# Altium schematic sheet DK_STM32L151.SchDoc: lock
size A4; Author: george; Revision: V1.0; SheetNumber: 1
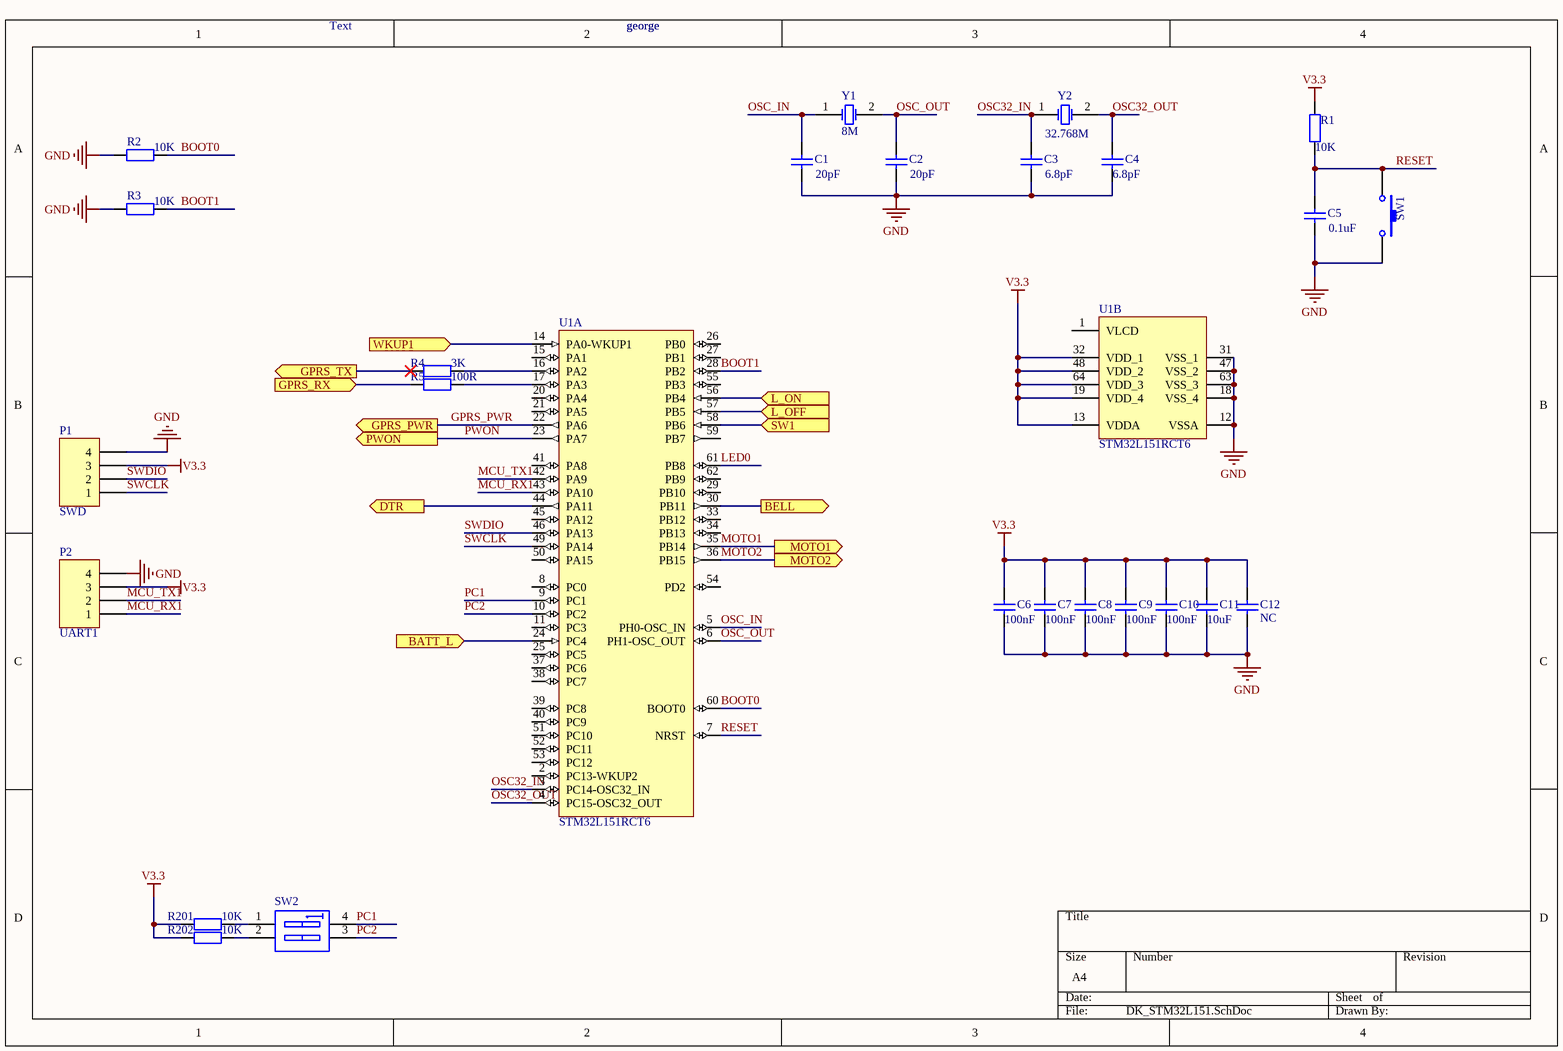
[diagram p0: DK_STM32L151.SchDoc]

## Parts
C1  value 20pF  [0603]  (hidden comment: Cap)
C2  value 20pF  [0603]  (hidden comment: Cap)
C3  value 6.8pF  [0603]  (hidden comment: Cap)
C4  value 6.8pF  [0603]  (hidden comment: Cap)
C5  value 0.1uF  [0603]  (hidden comment: Cap)
C6  value 100nF  [0603]  (hidden comment: Cap)
C7  value 100nF  [0603]  (hidden comment: Cap)
C8  value 100nF  [0603]  (hidden comment: Cap)
C9  value 100nF  [0603]  (hidden comment: Cap)
C10  value 100nF  [1206]  (hidden comment: Cap)
C11  value 10uF  [LC-CASE-A_3216]  (hidden comment: Cap)
C12  NC  [0603]
P1  SWD  [HDR1X4]
P2  UART1  [HDR1X4]
R1  value 10K  [0603]  (hidden comment: Res2)
R2  value 10K  [0603]  (hidden comment: Res2)
R3  value 10K  [0603]  (hidden comment: Res2)
R4  value 3K  [0603]  (hidden comment: Res2)
R5  value 100R  [0603]  (hidden comment: Res2)
R201  value 10K  [0603]  (hidden comment: Res2)
R202  value 10K  [0603]  (hidden comment: Res2)
SW1  SW-PB  [3*6*4.3]  (value not drawn)
SW2  SW DIP-2  [SW-2*4]  (value not drawn)
U1  STM32L151RCT6  [LQFP64]  (parts A,B of 2)
Y1  8M  [SMT-OSC]
Y2  32.768M  [XTAL32.786]

## Ports
BATT_L (in), BELL (out), DTR (out), GPRS_PWR (out), GPRS_RX (in), GPRS_TX (out), L_OFF (in), L_ON (in), MOTO1 (out), MOTO2 (out), PWON (out), SW1 (in), WKUP1 (in)

## Nets
GND: C1.1 C2.1 C3.1 C4.1 C5.2 C6.1 C7.1 C8.1 C9.1 C10.1 C11.1 C12.1 P1.4 P2.4 R2.1 R3.1 SW1.2 U1.12(VSSA) U1.18(VSS_4) U1.31(VSS_1) U1.47(VSS_2) U1.63(VSS_3)
V3.3: C6.2 C7.2 C8.2 C9.2 C10.2 C11.2 C12.2 P1.3 P2.3 R1.1 R201.1 R202.1 U1.13(VDDA) U1.19(VDD_4) U1.32(VDD_1) U1.48(VDD_2) U1.64(VDD_3)
BATT_L: U1.24(PC4) ; port BATT_L
BELL: U1.30(PB11) ; port BELL
BOOT0: R2.2 U1.60(BOOT0)
BOOT1: R3.2 U1.28(PB2)
DTR: U1.44(PA11) ; port DTR
GPRS_PWR: U1.22(PA6) ; port GPRS_PWR
GPRS_RX: R5.1 ; port GPRS_RX
GPRS_TX: R4.1 ; port GPRS_TX
L_OFF: U1.57(PB5) ; port L_OFF
L_ON: U1.56(PB4) ; port L_ON
LED0: U1.61(PB8)
MCU_RX1: P2.1 U1.43(PA10)
MCU_TX1: P2.2 U1.42(PA9)
MOTO1: U1.35(PB14) ; port MOTO1
MOTO2: U1.36(PB15) ; port MOTO2
OSC32_IN: C3.2 U1.3(PC14-OSC32_IN) Y2.1(OSC1)
OSC32_OUT: C4.2 U1.4(PC15-OSC32_OUT) Y2.2(OSC2)
OSC_IN: C1.2 U1.5(PH0-OSC_IN) Y1.1(OSC1)
OSC_OUT: C2.2 U1.6(PH1-OSC_OUT) Y1.2(OSC2)
PC1: SW2.4(B1) U1.9(PC1)
PC2: SW2.3(B2) U1.10(PC2)
PWON: U1.23(PA7) ; port PWON
RESET: C5.1 R1.2 SW1.1 U1.7(NRST)
SW1: U1.58(PB6) ; port SW1
SWCLK: P1.1 U1.49(PA14)
SWDIO: P1.2 U1.46(PA13)
WKUP1: U1.14(PA0-WKUP1) ; port WKUP1
NetR4_2: R4.2 U1.16(PA2)
NetR5_2: R5.2 U1.17(PA3)
NetR201_2: R201.2 SW2.1(A1)
NetR202_2: R202.2 SW2.2(A2)

Not connected (* = marked no-connect by the designer): U1 1(VLCD) 2(PC13-WKUP2) 8(PC0) 11(PC3) 15(PA1) 20(PA4) 21(PA5) 25(PC5) 26(PB0) 27(PB1) 29(PB10) 33(PB12) 34(PB13) 37(PC6) 38(PC7) 39(PC8) 40(PC9) 41(PA8) 45(PA12) 50(PA15) 51(PC10) 52(PC11) 53(PC12) 54(PD2) 55(PB3) 59(PB7) 62(PB9)

## Notes on the sheet
- Text

## Library data of the parts
C1-C11 = Cap: Capacitor; Published: 8-Jun-2000; LatestRevisionDate: 17-Jul-2002; LatestRevisionNote: Re-released for DXP Platform.; PackageReference: RAD-0.3; Publisher: Altium Limited; PackageDescription: Radial Cap, Thru-Hole; 2 Leads; 0.3 in Pin Spacing
C12 = Cap: Capacitor; Value: 10uF; Published: 8-Jun-2000; LatestRevisionDate: 17-Jul-2002; LatestRevisionNote: Re-released for DXP Platform.; PackageReference: RAD-0.3; Publisher: Altium Limited; PackageDescription: Radial Cap, Thru-Hole; 2 Leads; 0.3 in Pin Spacing
P1 P2 = Header 4: Header, 4-Pin; LatestRevisionDate: 17-Jul-2002; LatestRevisionNote: Re-released for DXP Platform.; Publisher: Altium Limited
R1-R5 R201 R202 = Res2: Resistor; Published: 8-Jun-2000; LatestRevisionDate: 17-Jul-2002; LatestRevisionNote: Re-released for DXP Platform.; PackageReference: AXIAL-0.4; Publisher: Altium Limited; PackageDescription: Axial Device, Thru-Hole; 2 Leads; 0.4 in Pin Spacing
SW1 = SW-PB: Switch; Published: 24-Mar-1999; LatestRevisionDate: 17-Jul-2002; LatestRevisionNote: Re-released for DXP Platform.; PackageReference: SPST-2; Publisher: Altium Limited; PackageDescription: Switch; 2 Leads
SW2 = SW DIP-2: DIP Switch, 2 Position, SPST; Published: 24-Mar-1999; LatestRevisionDate: 17-Jul-2002; LatestRevisionNote: Re-released for DXP Platform.; PackageReference: DIP-4; Publisher: Altium Limited
U1 = STM32L151RCT6: ARM Cortex-M3 32-bit MCU, 256 KB Flash, 32 KB Internal RAM, 51 I/Os, 64-pin LQFP, -40 to 85 degC, Tray; Manufacturer: STMicroelectronics; D/A Converter: 2x12-bit (2 Channel); Data E2PROM nom (B): 8192; FLASH Size (Prog) (kB): 256; I/Os (High Current): 51; Internal RAM Size (kB): 32; Supply Voltage(Vcc) min (V): 1.65; DatasheetVersion: Rev. 3; PackageVersion: Rev. 4, 06/2013; PackageReference: LQFP64; PackageDescription: 64-Pin Low Profile Quad Flat Package, 10 x 10 mm Body, 0.5 mm Pitch; Core: ARM Cortex-M3; Operating Frequency(F) (Processor speed) (MHz): 32; Packing: Tray; Mounting Technology: Surface Mount; PartNumber: STM32L151RCT6; ComponentLink1Description: Manufacturer URL; ComponentLink1URL: http://www.st.com/web/en/home.html; ComponentLink2Description: Datasheet; ComponentLink2URL: http://www.st.com/st-web-ui/static/active/en/resource/technical/document/datasheet/DM00048356.pdf; ComponentLink3Description: Package Specification; ComponentLink3URL: http://www.st.com/st-web-ui/static/active/en/resource/technical/document/datasheet/DM00037051.pdf
Y1 Y2 = XTAL: Crystal Oscillator; Published: 8-Jun-2000; LatestRevisionDate: 17-Jul-2002; LatestRevisionNote: Re-released for DXP Platform.; PackageReference: R38; Publisher: Altium Limited; PackageDescription: Crystal, Thru-Hole; 2 Leads; Body 3.1 x 8.2 mm (Dia.xH)